# Altium schematic sheet Sheet1.SchDoc
size A4; SheetNumber: 1; SheetTotal: 1
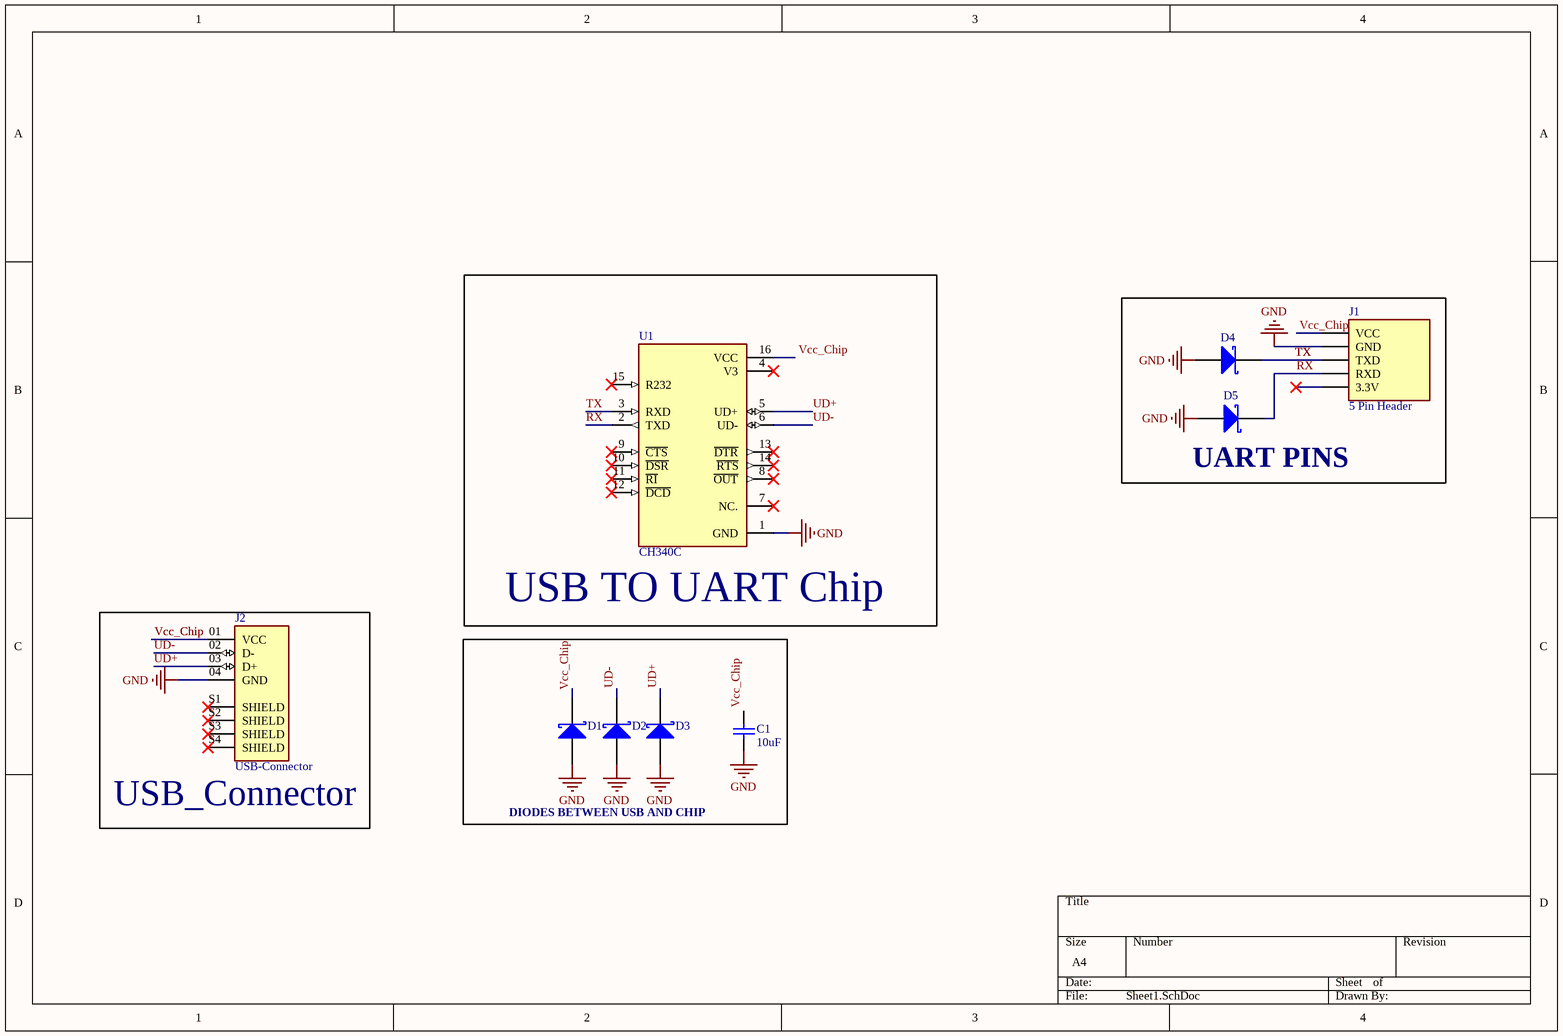
[diagram p0: Sheet1.SchDoc]

## Parts
C1  value 10uF  (hidden comment: Capacitor)
D1  Schottky Diode  (value not drawn)
D2  Schottky Diode  (value not drawn)
D3  Schottky Diode  (value not drawn)
D4  Schottky Diode  (value not drawn)
D5  Schottky Diode  (value not drawn)
J1  5 Pin Header  [SAMTEC_TSW-105-06-L-S]
J2  USB-Connector  [SAMTEC_USBR-A-S-F-O-VU]
U1  CH340C  [SOIC127P600X180-16N]

## Blocks framed on the sheet
USB TO UART Chip: U1
UART PINS: D4 D5 J1
USB_Connector: J2
DIODES BETWEEN USB AND CHIP: C1 D1-D3

## Nets
GND: C1.1 D1.1(A) D2.1(A) D3.1(A) D4.1(A) D5.1(A) J1.02(GND) J2.04(GND) U1.1(GND)
 Vcc_Chip: C1.2 D1.2(K) J1.01(VCC) J2.01(VCC) U1.16(VCC)
RX: D5.2(K) J1.04(RXD) U1.2(TXD)
TX: D4.2(K) J1.03(TXD) U1.3(RXD)
UD+: D3.2(K) J2.03(D+) U1.5(UD+)
UD-: D2.2(K) J2.02(D-) U1.6(UD-)

Not connected (* = marked no-connect by the designer): J1 05(3.3V)*; J2 S1(SHIELD)* S2(SHIELD)* S3(SHIELD)* S4(SHIELD)*; U1 4(V3)* 7(NC.)* 8(~{OUT})* 9(~{CTS})* 10(~{DSR})* 11(~{RI})* 12(~{DCD})* 13(~{DTR})* 14(~{RTS})* 15(R232)*

## Library data of the parts
C1 = Capacitor: SimulationGenericComponent: True
D1-D5 = Schottky Diode: AF: 1; BV: 0; BV_MAX: 1e99; EG: 1.11; FC: 0.5; IBV: 0.001; IS: 1e-14; MJSW: 0.33; NTUN: 30; TNOM: 27; XTI: 3; SimulationGenericComponent: True; CJO: 0; CJP: 0; CTA: 0; CTP: 0; FCS: 0.5; FV_MAX: 1e99; IKF: 0; IKR: 0; ISR: 1e-14; JSW: 0; JTUN: 0; JTUNSW: 0; KEG: 1; KF: 0; LEVEL: 1; N: 1; NBV: 1; NR: 1; NS: 1; PHP: 1; RS: 0; TCV: 0; TLEV: 0; TLEVC: 0; TM1: 0; TM2: 0; TPB: 0; TPHP: 0; TRS: 0; TRS2: 0; TT: 0; TTT1: 0; TTT2: 0; VJ: 1; XTITUN: 3
J1 = TSW-105-06-L-S: Package: None; Price: None; Value: *; MP: TSW-105-06-L-S; Availability: Unavailable
J2 = USBR-A-S-F-O-VU: USB-A _USB TYPE-A_ USB 2.0 Receptacle Connector 4 Position Through Hole; MF: Samtec; SnapEDA_Link: https://www.snapeda.com/parts/USBR-A-S-F-O-VU/Samtec%20Inc./view-part/932531/?ref=snap; Price: None; Availability: Unavailable; Package: None; MP: USBR-A-S-F-O-VU; Value: *
U1 = CH340C: USB to serial chip CH340; MF: WCH; Price: None; Availability: Not in stock; MP: CH340C; Package: None; SnapEDA_Link: https://www.snapeda.com/parts/CH340C/WCH/view-part/?ref=snap; Check_prices: https://www.snapeda.com/parts/CH340C/WCH/view-part/?ref=eda; Value: *